# EAGLE design BandpassedGainAmpSMT (EAGLE 9.5.1)
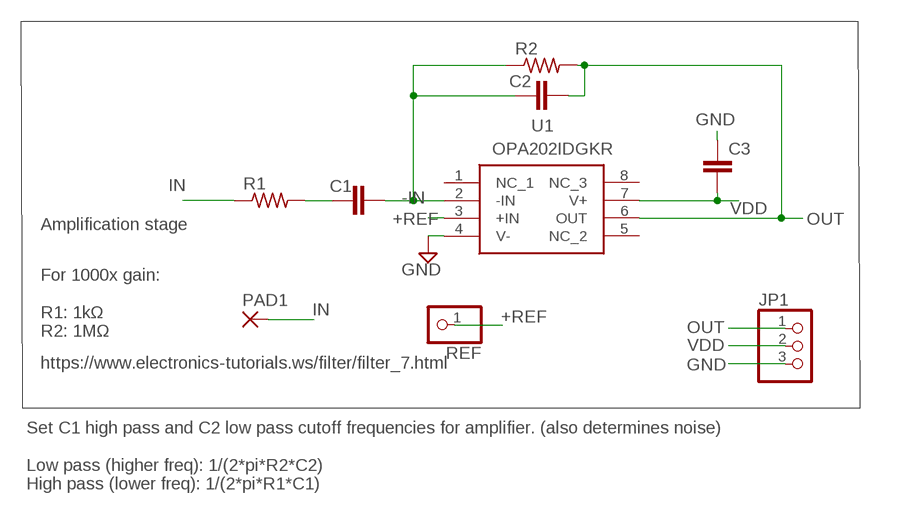
[diagram p0: schematic, sheet 1]

## Parts
C1  C-EUC0402  [C0402]
C2  C-EUC0402  [C0402]
C3  C-EUC0402  [C0402]
JP1  PINHD-1X3  [1X03]
PAD1  3,17/1,1  [3,17/1,1]
R1  R-US_R0402  [R0402]
R2  R-US_R0402  [R0402]
REF  PINHD-1X1  [1X01]
U1  OPA202IDGKR  [SOP65P490X110-8N]

## Nets
+REF: REF.1 U1.3(+IN)
-IN: C1.2 C2.1 R2.1 U1.2(-IN)
GND: C3.1 JP1.3 U1.4(V-)
IN: PAD1.1(P) R1.1
OUT: C2.2 JP1.1 R2.2 U1.6(OUT)
R1C1: C1.1 R1.2
VDD: C3.2 JP1.2 U1.7(V+)
Unconnected: U1.1(NC_1) U1.5(NC_2) U1.8(NC_3)

## Notes on the sheet
- Amplification stage
- For 1000x gain:
  
  R1: 1kΩ
  R2: 1MΩ
- https://www.electronics-tutorials.ws/filter/filter_7.html
- Set C1 high pass and C2 low pass cutoff frequencies for amplifier. (also determines noise)
  
  Low pass (higher freq): 1/(2*pi*R2*C2)
  High pass (lower freq): 1/(2*pi*R1*C1)

## Library data of the parts
C1-C3 = rcl:C-EU: CAPACITOR, European symbol; SPICEPREFIX: C
JP1 = pinhead:PINHD-1X3: PIN HEADER
PAD1 = wirepad:3,17/1,1: THROUGH-HOLE PAD
R1 R2 = rcl:R-US_: RESISTOR, American symbol; SPICEPREFIX: R
REF = pinhead:PINHD-1X1: PIN HEADER
U1 = OPA202IDGKR:OPA202IDGKR: Precision Amplifiers Low noise (0.2- uVPP, 9-nV/ Hz), heavy capacitive drive (25-nF), super beta, precision op amp 8-VSSOP -40 to 105 Source: Datasheet <https://www.ti.com/lit/ds/symlink/opa202.pdf?ts=1636402854008&ref_url=https%3A%2F%2Fwww.ti.com%2Fproduct%2FOPA202>; DESCRIPTION: Precision Amplifiers Low noise (0.2- uVPP, 9-nV/ Hz), heavy capacitive drive (25-nF), super beta, precision op amp 8-VSSOP -40 to 105; HEIGHT: 1.1mm; MANUFACTURER_NAME: Texas Instruments; MANUFACTURER_PART_NUMBER: OPA202IDGKR; MOUSER_PART_NUMBER: 595-OPA202IDGKR; MOUSER_PRICE-STOCK: https://www.mouser.co.uk/ProductDetail/Texas-Instruments/OPA202IDGKR?qs=7MVldsJ5UaxKAkmdzK%2FGCA%3D%3D

## Board
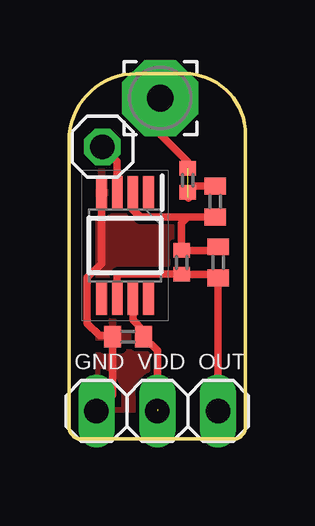
[diagram p1: board, top side]
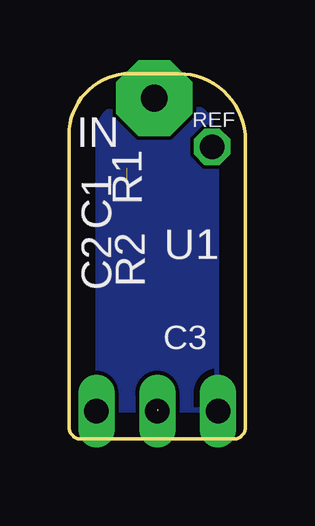
[diagram p2: board, bottom side, seen from below]

Size 7.37 x 15.24 mm. Coordinates in mm from the lower left corner, seen from the top.
Outline: 0,0.51 0,12.45 arc-90 2.79,15.24 4.83,15.24 arc-90 7.37,12.7 7.37,0.51 arc-90 6.86,0 0.51,0 arc-90 0,0.51
Copper layers (1*16): Top 0.035mm / dielectric 1.5mm / Bottom 0.035mm
Design rules "default": minimum track width 6mil, minimum drill 0.35mm, track to track 6mil, track to pad 6mil, pad to pad 6mil, via to via 6mil, smd to smd 6mil, copper to edge 40mil, drill to drill 6mil, minimum pad ring 10mil, minimum via ring 8mil, stop-mask expansion 4mil, vias tented up to drill 0mil, thermal gap 10mil

### Footprints (pad centres in the part's own frame; a part is rotated, then mirrored left to right if it is on the bottom)
C0402 = smd 0.7 x 0.9: 1 -0.65,0; 2 0.65,0
1X03 = drill 1.016 long: 1 -2.54,0; 2 0,0; 3 2.54,0
3,17/1,1 = drill 1.118 pad 3.175 octagon: 1 0,0
R0402 = smd 0.6 x 0.7: 1 -0.5,0; 2 0.5,0
1X01 = drill 1.016 octagon: 1 0,0
SOP65P490X110-8N = smd 1.4 x 0.45: 1 -2.2,0.975; 2 -2.2,0.325; 3 -2.2,-0.325; 4 -2.2,-0.975; 5 2.2,-0.975; 6 2.2,-0.325; 7 2.2,0.325; 8 2.2,0.975

### Placement (x,y rotation side)
C1  6.1,9.91 270 top
C2  6.22,7.37 270 top
C3  2.46,4.27 0 top
JP1  3.68,1.17 180 top
PAD1  3.81,14.22 0 top
R1  4.95,10.79 270 top
R2  4.7,7.37 270 top
REF  1.4,12.19 0 top
U1  2.34,8.08 270 top

### Tracks (layer width: path | path; a pad name or v marks a point on that pad's centre or on a via)
+REF
  Top 0.305: REF.1 2.01,11.58 U1.3
-IN
  Top 0.152: U1.2 | 5.98,9.14 C1.2
  Top 0.305: U1.2 2.66,9.58 2.98,9.26 C1.2 4.95,9.26 4.7,9.01 R2.1 6.07,7.87 C2.1
GND
  Top 0.305: U1.4 1.36,7.33 0.76,6.73 0.76,4.83 1.27,4.32 1.76,4.32 C3.1 1.81,1.84 JP1.3
  pour Top: -0.76,-0.51 8.38,-0.51 8.38,16.13 -0.76,16.13
  pour Bottom: -0.64,-0.89 -0.64,16 8.51,16 8.51,-0.89
IN  (1 unrouted)
  Top 0.305: PAD1.1 3.81,12.7 4.95,11.56 R1.1 | 4.97,10.05 4.95,10.07
OUT
  Top 0.152: 4.64,6.81 R2.2
  Top 0.305: JP1.1 C2.2 6.07,6.87 R2.2 | U1.6 2.01,6.84 2.06,6.88 4.56,6.88 4.64,6.81
R1C1
  Top 0.305: R1.2 5.28,10.56 C1.1
VDD  (1 unrouted)
  Top 0.152: 3.19,4.19 C3.2
  Top 0.305: U1.7 2.66,4.96 3.11,4.51 C3.2 3.68,3.7 3.68,1.25

### Text on the board
tNames: GND VDD OUT
bNames: IN